# EAGLE design G021H (EAGLE 6.6.0)
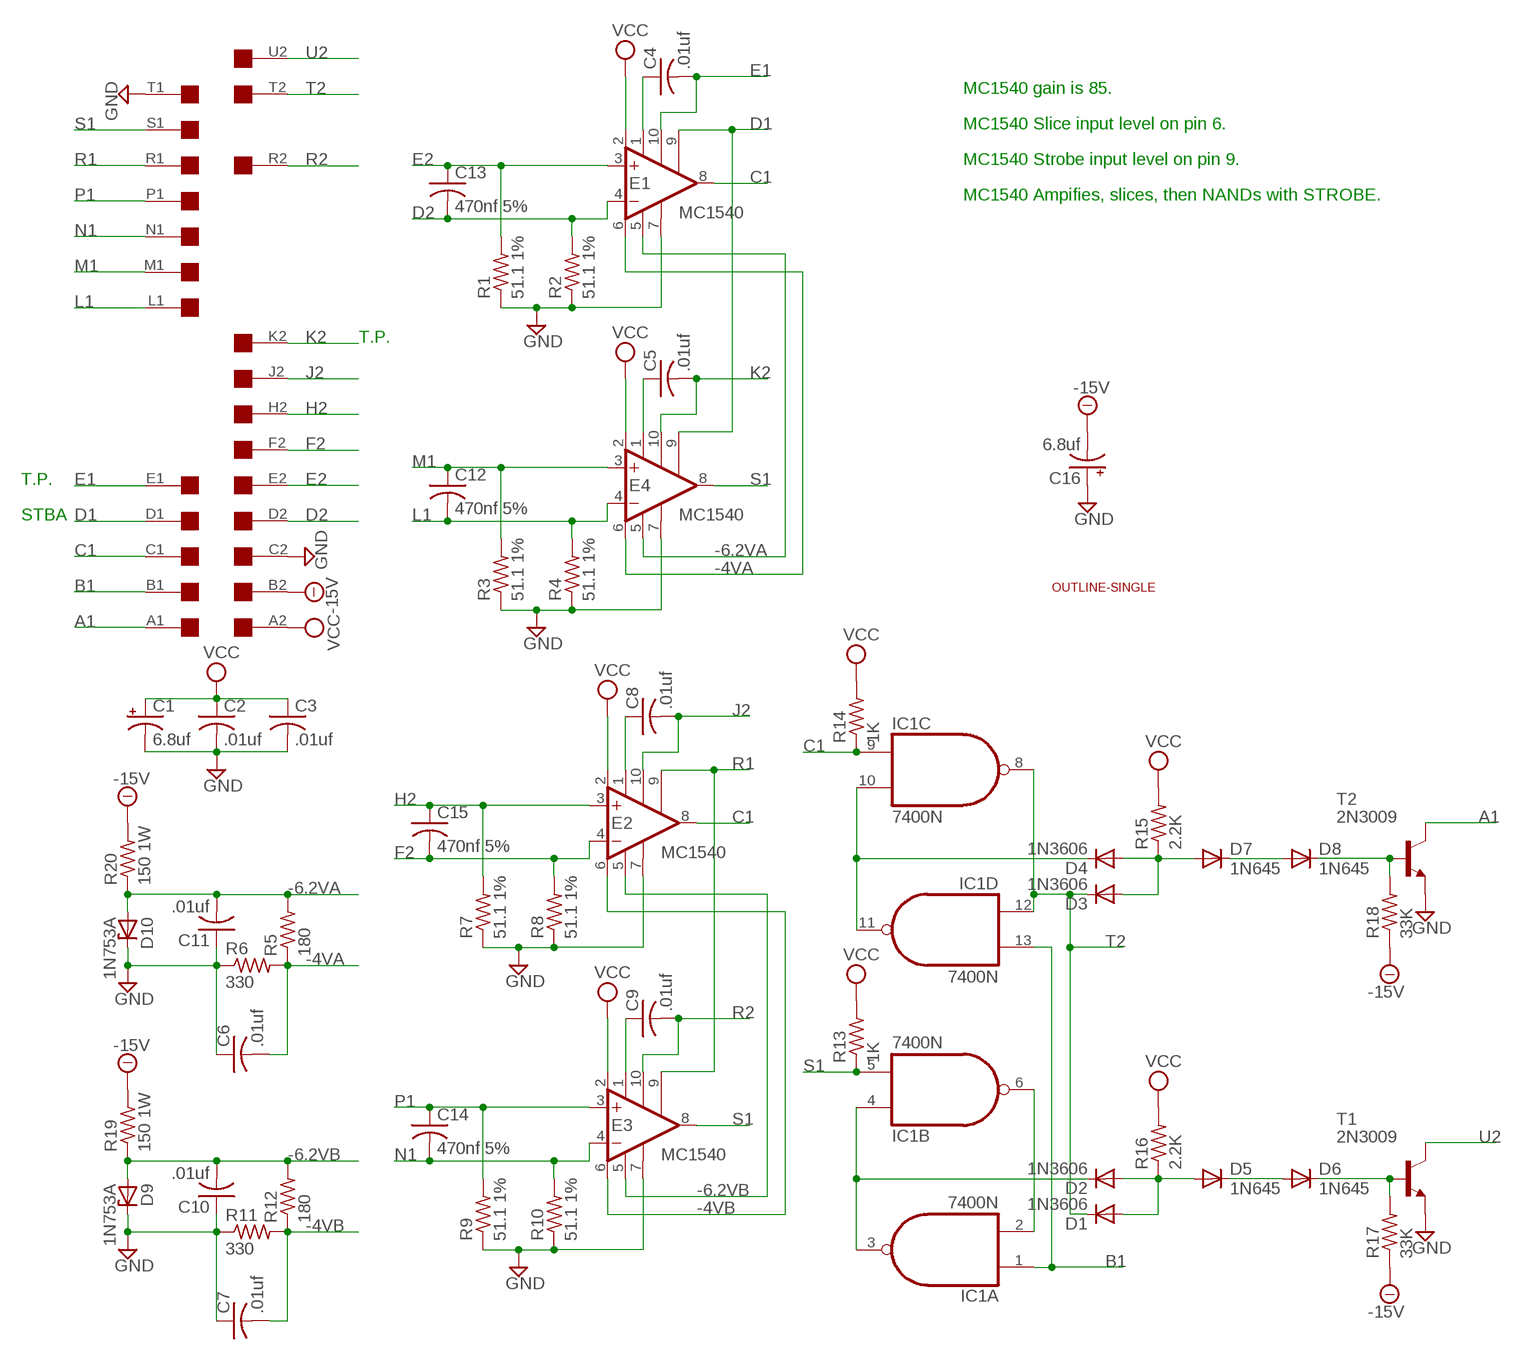
[diagram p0: schematic, sheet 1]

## Parts
C1  6.8uf  CPOL-USE22-6AXIAL  [E22-6]
C2  .01uf  C-US050-025X075  [C050-025X075]
C3  .01uf  C-US050-025X075  [C050-025X075]
C4  .01uf  C-US050-025X075  [C050-025X075]
C5  .01uf  C-US050-025X075  [C050-025X075]
C6  .01uf  C-US050-025X075  [C050-025X075]
C7  .01uf  C-US050-025X075  [C050-025X075]
C8  .01uf  C-US050-025X075  [C050-025X075]
C9  .01uf  C-US050-025X075  [C050-025X075]
C10  .01uf  C-US050-025X075  [C050-025X075]
C11  .01uf  C-US050-025X075  [C050-025X075]
C12  470nf 5%  C-US050-025X075  [C050-025X075]
C13  470nf 5%  C-US050-025X075  [C050-025X075]
C14  470nf 5%  C-US050-025X075  [C050-025X075]
C15  470nf 5%  C-US050-025X075  [C050-025X075]
C16  6.8uf  CPOL-USE22-6AXIAL  [E22-6]
D1  1N3606  1N4148  [DO35-10]
D2  1N3606  1N4148  [DO35-10]
D3  1N3606  1N4148  [DO35-10]
D4  1N3606  1N4148  [DO35-10]
D5  1N645  1N4148  [DO35-10]
D6  1N645  1N4148  [DO35-10]
D7  1N645  1N4148  [DO35-10]
D8  1N645  1N4148  [DO35-10]
D9  1N753A  ZENER-DIODEF126-10  [F126Z10]
D10  1N753A  ZENER-DIODEF126-10  [F126Z10]
E1  MC1540  MC1540G  [602B]
E2  MC1540  MC1540G  [602B]
E3  MC1540  MC1540G  [602B]
E4  MC1540  MC1540G  [602B]
IC1  7400N  [DIL14]
R1  51.1 1%  R-US_0207/10  [0207/10]
R2  51.1 1%  R-US_0207/10  [0207/10]
R3  51.1 1%  R-US_0207/10  [0207/10]
R4  51.1 1%  R-US_0207/10  [0207/10]
R5  180  R-US_0207/10  [0207/10]
R6  330  R-US_0207/10  [0207/10]
R7  51.1 1%  R-US_0207/10  [0207/10]
R8  51.1 1%  R-US_0207/10  [0207/10]
R9  51.1 1%  R-US_0207/10  [0207/10]
R10  51.1 1%  R-US_0207/10  [0207/10]
R11  330  R-US_0207/10  [0207/10]
R12  180  R-US_0207/10  [0207/10]
R13  1K  R-US_0207/10  [0207/10]
R14  1K  R-US_0207/10  [0207/10]
R15  2.2K  R-US_0207/10  [0207/10]
R16  2.2K  R-US_0207/10  [0207/10]
R17  33K  R-US_0207/10  [0207/10]
R18  33K  R-US_0207/10  [0207/10]
R19  150 1W  R-US_0414/15  [0414/15]
R20  150 1W  R-US_0414/15  [0414/15]
T1  2N3009  2N3565  [TO92]
T2  2N3009  2N3565  [TO92]
U$1  SINGLE  [EDGE-CON2]
U$2  OUTLINE-SINGLE  [SINGLE]

## Nets
-4VA: C6.2 E1.6(SLICE) E4.6(SLICE) R5.1 R6.2
-4VB: C7.2 E2.6(SLICE) E3.6(SLICE) R11.2 R12.1
-6.2VA: C11.2 D10.A E1.5(V-) E4.5(V-) R5.2 R20.1
-6.2VB: C10.2 D9.A E2.5(V-) E3.5(V-) R12.2 R19.1
-15V: C16.- R17.1 R18.1 R19.2 R20.2 U$1.B2
A1: T2.1(C) U$1.A1
B1: IC1.1(A:I0) IC1.13(D:I1) U$1.B1
C1: E1.8(OUT) E2.8(OUT) IC1.9(C:I0) R14.1 U$1.C1
D1: E1.9(ISTROBE) E4.9(ISTROBE) U$1.D1
D2: C13.2 E1.4(-IN) R2.2 U$1.D2
E1: C4.2 E1.10(CEXTB) U$1.E1
E2: C13.1 E1.3(+IN) R1.2 U$1.E2
F2: C15.2 E2.4(-IN) R8.2 U$1.F2
GND: C1.- C2.2 C3.2 C6.1 C7.1 C10.1 C11.1 C16.+ D9.C D10.C E1.7(GND) E2.7(GND) E3.7(GND) E4.7(GND) R1.1 R2.1 R3.1 R4.1 R6.1 R7.1 R8.1 R9.1 R10.1 R11.1 T1.3(E) T2.3(E) U$1.C2 U$1.T1
H2: C15.1 E2.3(+IN) R7.2 U$1.H2
J2: C8.2 E2.10(CEXTB) U$1.J2
K2: C5.2 E4.10(CEXTB) U$1.K2
L1: C12.2 E4.4(-IN) R4.2 U$1.L1
M1: C12.1 E4.3(+IN) R3.2 U$1.M1
N1: C14.2 E3.4(-IN) R10.2 U$1.N1
N$1: C4.1 E1.1(CEXTA)
N$2: C8.1 E2.1(CEXTA)
N$3: C5.1 E4.1(CEXTA)
N$4: C9.1 E3.1(CEXTA)
N$6: D1.A D2.A D5.A R16.1
N$7: D4.C IC1.10(C:I1) IC1.11(D:O)
N$8: D2.C IC1.3(A:O) IC1.4(B:I0)
N$9: IC1.2(A:I1) IC1.6(B:O)
N$10: D3.A D4.A D7.A R15.1
N$11: D7.C D8.A
N$12: D5.C D6.A
N$13: D8.C R18.2 T2.2(B)
N$14: D6.C R17.2 T1.2(B)
P1: C14.1 E3.3(+IN) R9.2 U$1.P1
R1: E2.9(ISTROBE) E3.9(ISTROBE) U$1.R1
R2: C9.2 E3.10(CEXTB) U$1.R2
S1: E3.8(OUT) E4.8(OUT) IC1.5(B:I1) R13.1 U$1.S1
T2: D1.C D3.C IC1.8(C:O) IC1.12(D:I0) U$1.T2
U2: T1.1(C) U$1.U2
VCC: C1.+ C2.1 C3.1 E1.2(V+) E2.2(V+) E3.2(V+) E4.2(V+) R13.2 R14.2 R15.2 R16.2 U$1.A2
Unconnected: U$1.F1 U$1.H1 U$1.J1 U$1.K1 U$1.L2 U$1.M2 U$1.N2 U$1.P2 U$1.S2 U$1.U1 U$1.V1 U$1.V2

## Notes on the sheet
- MC1540 gain is 85.
- MC1540 Slice input level on pin 6.
- MC1540 Strobe input level on pin 9.
- MC1540 Ampifies, slices, then NANDs with STROBE.
- T.P.
- T.P.
- STBA

## Power pins joined to a net without a drawn wire
GND: IC1.7(P:GND)
VCC: IC1.14(P:VCC)

## Library data of the parts
C1 C16 = rcl:CPOL-US: POLARIZED CAPACITOR, American symbol
C2-C15 = rcl:C-US: CAPACITOR, American symbol
D1-D8 = diode:1N4148: DIODE high speed (Philips)
D9 D10 = diode:ZENER-DIODE: Z-Diode
E1-E4 = dec-con:MC1540: OP AMP
IC1 = 74xx-us:74*00: Quad 2-input NAND gate
R1-R20 = rcl:R-US_: RESISTOR, American symbol
T1 T2 = transistor:2N3565: NPN TRANSISTOR
U$1 = dec-con:SINGLE: Single-Height DEC board
U$2 = dec-con:OUTLINE-*: Board outlines for DEC boards.

## Board
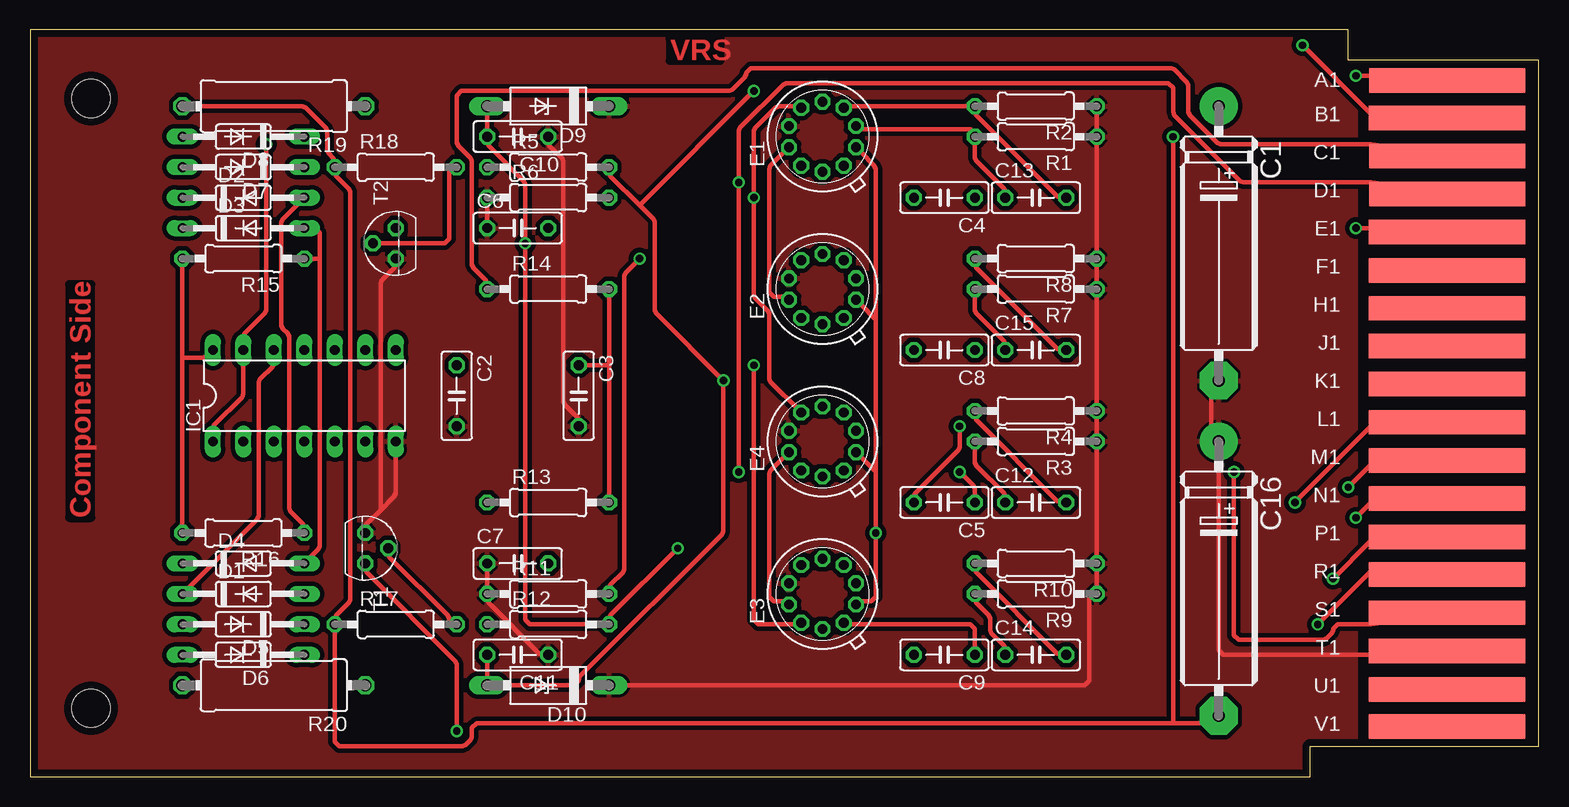
[diagram p1: board, top side]
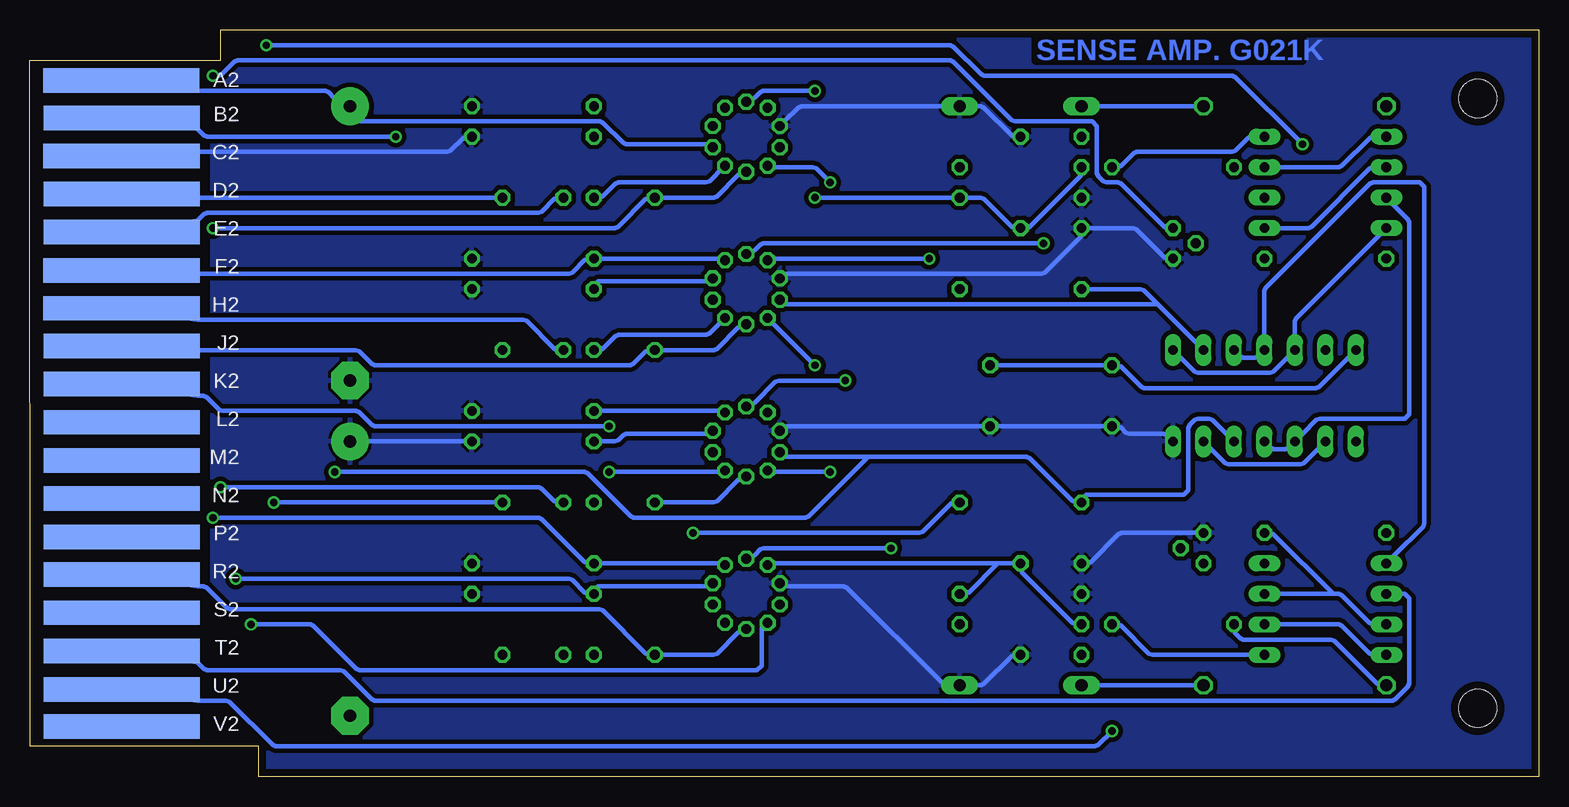
[diagram p2: board, bottom side, seen from below]

Size 125.73 x 62.23 mm. Coordinates in mm from the lower left corner, seen from the top.
Copper layers (1*16): Top 0.035mm / dielectric 1.5mm / Bottom 0.035mm
Design rules "15mils": minimum track width 15mil, minimum drill 24mil, track to track 15mil, track to pad 10mil, pad to pad 10mil, via to via 10mil, smd to smd 10mil, copper to edge 25mil, drill to drill 10mil, minimum pad ring 10mil, minimum via ring 8mil, stop-mask expansion 0mil, vias tented up to drill 0mil, thermal gap 10mil

### Footprints (pad centres in the part's own frame; a part is rotated, then mirrored left to right if it is on the bottom)
E22-6 = drill 1.016 pad 3.15: + -11.43,0 | drill 1.016 pad 3.15 octagon: - 11.43,0
C050-025X075 = drill 0.813 octagon: 1 -2.54,0; 2 2.54,0
DO35-10 = drill 0.813 long: A 5.08,0; C -5.08,0
F126Z10 = drill 1.016 long: A 5.08,0; C -5.08,0
602B = drill 0.813 octagon: 1 -2.413,-1.778; 2 -0.889,-2.794; 3 0.889,-2.794; 4 2.413,-1.778; 5 2.921,0; 6 2.413,1.778; 7 0.889,2.794; 8 -0.889,2.794; 9 -2.413,1.778; 10 -2.921,0
DIL14 = drill 0.813 long: 1 -7.62,-3.81; 2 -5.08,-3.81; 3 -2.54,-3.81; 4 0,-3.81; 5 2.54,-3.81; 6 5.08,-3.81; 7 7.62,-3.81; 8 7.62,3.81; 9 5.08,3.81; 10 2.54,3.81; 11 0,3.81; 12 -2.54,3.81; 13 -5.08,3.81; 14 -7.62,3.81
0207/10 = drill 0.813 octagon: 1 -5.08,0; 2 5.08,0
0414/15 = drill 1.016 octagon: 1 -7.62,0; 2 7.62,0
TO92 = drill 0.813 octagon: 1 1.27,0; 2 0,1.905; 3 -1.27,0
EDGE-CON2 = smd 13.017 x 2.032: A1 7.633,4.207; B1 7.639,7.327; C1 7.636,10.489; D1 7.633,13.665; E1 7.642,16.84; F1 7.642,20.041; H1 7.642,23.19; J1 7.642,26.34; K1 7.642,29.515; L1 7.642,32.69; M1 7.642,35.89; N1 7.642,39.04; P1 7.642,42.24; R1 7.642,45.39; S1 7.642,48.565; T1 7.642,51.74; U1 7.642,54.966; V1 7.642,58.026 | smd 13.017 x 2.032 bottom: A2 7.614,4.207; B2 7.642,7.328; C2 7.617,10.49; D2 7.642,13.665; E2 7.642,16.84; F2 7.617,20.041; H2 7.617,23.19; J2 7.642,26.34; K2 7.642,29.515; L2 7.642,32.69; M2 7.642,35.89; N2 7.642,39.04; P2 7.642,42.24; R2 7.642,45.39; S2 7.642,48.565; T2 7.642,51.74; U2 7.642,54.966; V2 7.642,58.026
SINGLE = hole 3.175: 120.65,56.515; 120.65,5.715

### Placement (x,y rotation side)
C1  99.06,44.45 270 top
C2  35.56,31.75 270 top
C3  45.72,31.75 270 top
C4  76.2,48.26 180 top
C5  76.2,22.86 180 top
C6  40.64,45.72 0 top
C7  40.64,17.78 0 top
C8  76.2,35.56 180 top
C9  76.2,10.16 180 top
C10  40.64,53.34 180 top
C11  40.64,10.16 180 top
C12  83.82,22.86 0 top
C13  83.82,48.26 0 top
C14  83.82,10.16 0 top
C15  83.82,35.56 0 top
C16  99.06,16.51 270 top
D1  17.78,15.24 0 top
D2  17.78,48.26 0 top
D3  17.78,45.72 0 top
D4  17.78,17.78 0 top
D5  17.78,12.7 180 top
D6  17.78,10.16 180 top
D7  17.78,50.8 180 top
D8  17.78,53.34 180 top
D9  43.18,55.88 180 top
D10  43.18,7.62 180 top
E1  66.04,53.34 90 top
E2  66.04,40.64 90 top
E3  66.04,15.24 90 top
E4  66.04,27.94 90 top
IC1  22.86,31.75 0 top
R1  83.82,53.34 180 top
R2  83.82,55.88 180 top
R3  83.82,27.94 180 top
R4  83.82,30.48 180 top
R5  43.18,50.8 0 top
R6  43.18,48.26 0 top
R7  83.82,40.64 180 top
R8  83.82,43.18 180 top
R9  83.82,15.24 180 top
R10  83.82,17.78 180 top
R11  43.18,15.24 0 top
R12  43.18,12.7 0 top
R13  43.18,22.86 0 top
R14  43.18,40.64 0 top
R15  17.78,43.18 180 top
R16  17.78,20.32 180 top
R17  30.48,12.7 0 top
R18  30.48,50.8 0 top
R19  20.32,55.88 180 top
R20  20.32,7.62 180 top
T1  27.94,19.05 270 top
T2  30.48,44.45 90 top
U$1  125.73,62.23 180 top
U$2  125.73,62.23 180 top

### Tracks (layer width: path | path; a pad name or v marks a point on that pad's centre or on a via)
-4VA  (via drill 0.61)
  Top 0.381: E4.6 64.14,30.48 61.71,32.91 61.59,33.18 61.59,38.58 61.48,38.85 60.44,39.89 60.33,40.16 v60.33,48.26 60.33,53.82 60.44,54.09 62.12,55.77 62.39,55.88 63.98,55.88 64.25,55.77 E1.6
  Bottom 0.381: R5.1 38.1,50.32 38.21,50.05 42.43,45.83 42.7,45.72 C6.2 43.66,45.72 43.93,45.83 46.24,48.15 46.51,48.26 47.62,48.26 R6.2 48.9,48.26 v60.33,48.26
-4VB  (via drill 0.61)
  Top 0.381: v50.8,43.18 49.64,42.02 49.53,41.75 49.53,17.3 49.42,17.03 48.37,15.99 48.26,15.72 R11.2
  Bottom 0.381: R12.1 38.58,12.7 38.85,12.81 43.07,17.03 43.18,17.3 C7.2 43.81,17.78 45.09,17.78 | 45.09,17.78 47.51,15.35 47.78,15.24 R11.2 | 45.09,17.78 63.98,17.78 64.25,17.67 E3.6 | v50.8,43.18 63.98,43.18 64.25,43.07 E2.6
-6.2VA  (via drill 0.61)
  Top 0.381: C11.2 38.1,9.53 38.1,8.26 D10.A 39.37,7.62 45.34,7.62 45.72,8 45.72,8.1 45.83,8.37 57.67,20.21 57.78,20.48 v57.78,33.02 52.18,38.62 52.07,38.89 52.07,46.2 51.96,46.47 50.8,47.62 | 50.8,47.62 48.37,50.05 48.26,50.32 R5.2 | 50.8,47.62 v60.33,57.15
  Bottom 0.381: R20.1 28.57,7.62 36.83,7.62 D10.A | v57.78,33.02 63.34,33.02 63.61,32.91 65.35,31.17 65.48,31.09 E4.5 | v60.33,57.15 64.61,57.15 64.88,57.04 65.35,56.57 65.48,56.49 E1.5
-6.2VB  (via drill 0.61)
  Top 0.381: v53.98,19.05 48.37,13.45 48.26,13.18 R12.2 47.62,12.7 41.66,12.7 41.27,13.08 v41.27,44.45 41.27,49.37 41.16,49.64 38.21,52.59 38.1,52.86 C10.2 38.1,53.98 38.1,55.24 D9.A
  Bottom 0.381: R19.1 28.57,55.88 36.83,55.88 D9.A | v53.98,19.05 64.61,19.05 64.88,18.94 65.35,18.47 65.48,18.39 E3.5 | v41.27,44.45 64.61,44.45 64.88,44.34 65.35,43.87 65.48,43.79 E2.5
-15V  (via drill 0.61)
  Top 0.381: R19.2 13.34,55.88 22.7,55.88 22.97,55.77 24.65,54.09 24.77,53.82 24.77,52.23 24.88,51.96 25.29,51.55 25.4,51.28 R18.1 25.4,50.32 25.51,50.05 26.56,49.01 26.67,48.74 26.67,14.76 26.56,14.49 25.51,13.45 25.4,13.18 R17.1 25.4,12.06 25.4,2.92 25.78,2.54 36.04,2.54 36.31,2.65 36.72,3.06 36.83,3.33 36.83,4.06 37.21,4.45 95.25,4.45 | 95.25,4.45 97.7,4.45 97.87,4.49 C16.- | 95.25,4.45 v95.25,53.34
  Bottom 0.381: R17.1 25.4,12.22 25.29,11.95 24.88,11.54 24.61,11.43 17.3,11.43 17.03,11.32 13.45,7.73 13.18,7.62 R20.2 | v95.25,53.34 110.97,53.34 111.24,53.45 111.67,53.89 111.89,53.99 U$1.B2
A1  (via drill 0.61)
  Top 0.381: v110.49,58.42 111.75,58.42 111.77,58.42 U$1.A1
  Bottom 0.381: T2.1 30.96,45.72 31.23,45.83 34.81,49.42 35.08,49.53 36.04,49.53 36.31,49.64 36.72,50.05 36.83,50.32 36.83,54.23 37.21,54.61 43.66,54.61 43.93,54.72 48.78,59.58 49.05,59.69 108.43,59.69 108.7,59.58 109.74,58.53 110.01,58.42 v110.49,58.42
B1  (via drill 0.61)
  Top 0.381: IC1.1 15.24,29.05 15.35,29.32 17.67,31.64 17.78,31.91 17.78,34.29 IC1.13 17.78,36.67 17.89,36.94 19.57,38.62 19.68,38.89 v19.68,52.7 | v106.05,60.96 111.66,55.35 111.91,55.24 U$1.B1
  Bottom 0.381: v19.68,52.7 25.29,58.31 25.56,58.42 46.2,58.42 46.47,58.53 48.78,60.85 49.05,60.96 v106.05,60.96
C1
  Top 0.381: E2.8 62.96,39.94 62.75,40.01 61.98,40.01 61.59,40.39 61.59,50.64 61.71,50.91 62.87,52.07 E1.8 | U$1.C1 111.79,52.7 111.73,52.7 99.22,52.7 98.95,52.82 96.63,55.13 96.52,55.4 96.52,57.63 96.41,57.9 95.36,58.94 95.09,59.05 60.07,59.05 59.69,58.67 59.69,58.58 59.58,58.31 58.53,57.26 58.26,57.15 35.94,57.15 35.56,56.77 35.56,52.86 35.67,52.59 36.72,51.55 36.83,51.28 36.83,42.7 36.94,42.43 37.99,41.39 38.1,41.12 R14.1
  Bottom 0.381: 31.75,39.37 28.57,36.2 IC1.9 | 31.75,39.37 32.91,40.53 33.18,40.64 37.47,40.64 R14.1 | 31.75,39.37 62.71,39.37 62.98,39.48 E2.8
D1  (via drill 0.61)
  Top 0.381: v59.05,25.4 v59.05,49.53 59.05,53.82 59.17,54.09 62.75,57.67 63.02,57.78 94.87,57.78 95.25,57.4 95.25,55.4 95.36,55.13 100.85,49.64 101.12,49.53 111.73,49.53 111.79,49.53 U$1.D1
  Bottom 0.381: v59.05,25.4 63.98,25.4 64.25,25.51 E4.9 | v59.05,49.53 60.21,50.69 60.48,50.8 63.98,50.8 64.25,50.91 E1.9
D2
  Top 0.381: E1.4 67.83,55.77 68.1,55.88 78.11,55.88 R2.2 78.74,55.4 78.85,55.13 85.61,48.37 85.88,48.26 C13.2
  Bottom 0.381: C13.2 87,48.26 111.75,48.26 111.77,48.26 U$1.D2
E1  (via drill 0.61)
  Top 0.381: v110.49,45.72 111.75,45.72 111.77,45.72 U$1.E1
  Bottom 0.381: E1.10 66.6,50.19 66.73,50.11 68.47,48.37 68.74,48.26 73.03,48.26 C4.2 74.14,48.26 74.41,48.15 76.72,45.83 76.99,45.72 v110.49,45.72
E2
  Top 0.381: C13.1 81.28,48.74 81.17,49.01 78.85,51.32 78.74,51.59 78.74,52.7 R1.2 78.74,53.59 78.36,53.98 69.33,53.98 69.12,54.04 E1.3
  Bottom 0.381: C13.1 81.76,48.26 82.03,48.15 83.07,47.1 83.34,46.99 110.97,46.99 111.24,46.88 111.67,46.44 111.88,46.34 U$1.E2
F2
  Top 0.381: R8.2 78.74,42.7 78.85,42.43 85.61,35.67 85.88,35.56 C15.2
  Bottom 0.381: E2.4 67.83,43.07 68.1,43.18 78.11,43.18 R8.2 79.22,43.18 79.49,43.07 80.53,42.02 80.8,41.91 111.75,41.91 111.77,41.91 U$1.F2
GND
  Top 0.381: R6.1 38.1,47.62 38.1,46.35 C6.1 | C7.1 38.1,17.14 38.1,15.88 R11.1 38.1,14.76 38.21,14.49 42.43,10.27 42.7,10.16 C11.1 | 29.21,22.23 30.37,23.38 30.48,23.65 30.48,26.67 IC1.7 | T1.3 27.94,20.8 28.05,21.07 29.21,22.23 | C10.1 43.18,52.86 43.29,52.59 44.34,51.55 44.45,51.28 44.45,31.27 44.56,31 45.61,29.96 45.72,29.69 C3.2 | 29.21,22.23 29.21,41.12 29.32,41.39 30.37,42.43 30.48,42.7 T2.3 | C1.- 98.47,31.83 98.42,31.66 98.42,29.3 98.47,29.13 C16.+ 99.06,26.67 99.06,10.54 99.44,10.16 111.75,10.16 111.77,10.16 U$1.T1 | R2.1 88.9,55.24 88.9,53.98 R1.1 88.9,52.7 88.9,43.81 R8.1 88.9,42.55 88.9,41.27 R7.1 88.9,40.01 88.9,31.11 R4.1 88.9,29.84 88.9,28.57 R3.1 88.9,27.3 88.9,18.41 R10.1 88.9,17.14 88.9,15.88 R9.1 88.65,15.24 88.27,14.86 88.27,8 87.88,7.62 49.53,7.62 D10.C
  Bottom 0.381: T2.3 30.96,43.18 31.23,43.29 33.54,45.61 33.81,45.72 37.47,45.72 C6.1 38.1,45.24 38.21,44.97 41.16,42.02 41.43,41.91 62.71,41.91 62.98,41.8 E2.7 | C11.1 43.66,10.16 43.93,10.05 46.24,7.73 46.51,7.62 46.99,7.62 D10.C 49.37,7.62 49.64,7.73 57.67,15.76 57.94,15.88 62.75,15.88 62.96,15.94 E3.7 | C10.1 43.66,53.34 43.93,53.45 46.24,55.77 46.51,55.88 46.99,55.88 D9.C 49.53,55.88 61.44,55.88 61.71,55.77 62.87,54.61 E1.7 | IC1.7 31,28.46 31.27,28.57 34.13,28.57 34.4,28.69 34.81,29.1 35.08,29.21 C2.2 36.2,29.21 45.09,29.21 C3.2 46.35,29.21 62.71,29.21 62.98,29.1 E4.7 | C7.1 37.62,17.78 37.35,17.89 35.04,20.21 34.77,20.32 28.57,20.32 T1.3 | C16.+ 97.79,27.94 89.53,27.94 R3.1 | R1.1 89.38,53.34 89.65,53.23 90.69,52.18 90.96,52.07 111.75,52.07 111.77,52.07 U$1.C2
  pour Top (isolate 0.381): 0,0 110.11,0 110.49,0.38 110.49,62.23 0.38,62.23 0,61.85
  pour Bottom (isolate 0.381): 0,0 110.11,0 110.49,0.38 110.49,62.23 0.38,62.23 0,61.85
H2
  Top 0.381: C15.1 81.28,36.04 81.17,36.31 78.85,38.62 78.74,38.89 78.74,40.01 R7.2
  Bottom 0.381: E2.3 69.12,41.34 69.33,41.27 78.36,41.27 78.74,40.89 R7.2 | C15.1 81.76,35.56 82.03,35.67 84.34,37.99 84.61,38.1 111.73,38.1 111.79,38.1 U$1.H2
J2
  Bottom 0.381: E2.10 66.6,37.49 66.73,37.41 68.47,35.67 68.74,35.56 73.03,35.56 C8.2 74.14,35.56 74.41,35.45 75.45,34.4 75.72,34.29 97,34.29 97.27,34.4 98.31,35.45 98.58,35.56 111.75,35.56 111.77,35.56 U$1.J2
K2  (via drill 0.61)
  Top 0.381: C5.2 73.66,23.34 73.77,23.61 77.36,27.19 77.47,27.46 v77.47,29.21
  Bottom 0.381: E4.10 66.6,24.79 66.73,24.71 68.47,22.97 68.74,22.86 73.03,22.86 C5.2 | v77.47,29.21 97,29.21 97.27,29.32 98.31,30.37 98.58,30.48 109.7,30.48 109.97,30.59 111.01,31.64 111.28,31.75 111.73,31.75 111.79,31.75 U$1.K2
L1  (via drill 0.61)
  Top 0.381: R4.2 78.74,30 78.85,29.73 85.61,22.97 85.88,22.86 C12.2 | v105.41,22.86 111.66,29.11 111.91,29.22 U$1.L1
  Bottom 0.381: E4.4 67.83,30.37 68.1,30.48 78.11,30.48 R4.2 | v105.41,22.86 87,22.86 C12.2
M1  (via drill 0.61)
  Top 0.381: C12.1 81.28,23.34 81.17,23.61 78.85,25.92 78.74,26.19 78.74,27.3 R3.2 | v109.86,24.13 111.66,25.93 111.91,26.04 U$1.M1
  Bottom 0.381: E4.3 69.12,28.64 69.33,28.57 76.04,28.57 76.31,28.46 76.72,28.05 76.99,27.94 78.11,27.94 R3.2 | C12.1 81.76,22.86 82.03,22.97 83.07,24.02 83.34,24.13 v109.86,24.13
N1  (via drill 0.61)
  Top 0.381: R10.2 78.74,17.3 78.85,17.03 85.61,10.27 85.88,10.16 C14.2 | v110.49,21.59 111.66,22.76 111.91,22.87 U$1.N1
  Bottom 0.381: E3.4 67.83,17.67 68.1,17.78 78.11,17.78 R10.2 79.22,17.78 79.49,17.89 83.07,21.48 83.34,21.59 v110.49,21.59
N$1
  Bottom 0.381: E1.1 67.94,50.8 69.1,49.64 69.37,49.53 76.68,49.53 76.95,49.42 77.99,48.37 78.26,48.26 C4.1
N$2
  Bottom 0.381: E2.1 67.94,38.1 69.1,36.94 69.37,36.83 76.68,36.83 76.95,36.72 77.99,35.67 78.26,35.56 C8.1
N$3  (via drill 0.61)
  Top 0.381: v77.47,25.4 78.63,24.24 78.74,23.97 78.74,23.5 C5.1
  Bottom 0.381: E4.1 67.83,25.51 68.1,25.4 v77.47,25.4
N$4
  Top 0.381: E3.1 67.83,12.81 68.1,12.7 78.36,12.7 78.74,12.32 78.74,10.79 C9.1
N$6
  Top 0.381: D2.A 22.23,47.62 21.07,46.47 20.95,46.2 20.95,37.62 21.07,37.35 21.48,36.94 21.59,36.67 21.59,22.38 21.7,22.11 22.75,21.07 22.86,20.8 R16.1
  Bottom 0.381: 17.14,15.24 21.59,15.24 D1.A | D5.A 13.81,12.7 14.08,12.81 16.4,15.13 16.67,15.24 17.14,15.24 | 17.14,15.24 22.11,20.21 22.38,20.32 R16.1
N$7
  Bottom 0.381: D4.C 12.06,18.41 9.64,20.84 9.53,21.11 9.53,49.15 9.91,49.53 13.81,49.53 14.08,49.42 22.75,40.75 22.86,40.48 22.86,36.83 IC1.11 23.38,35.04 23.65,34.92 24.61,34.92 24.88,35.04 IC1.10
N$8
  Bottom 0.381: IC1.4 22.34,27.42 22.07,27.3 21.11,27.3 20.84,27.42 IC1.3 19.68,28.57 18.53,29.73 18.26,29.84 11.18,29.84 10.79,30.23 10.79,46.2 10.91,46.47 12.06,47.62 D2.C
N$9
  Bottom 0.381: IC1.2 18.41,27.3 19.57,26.15 19.84,26.04 25.88,26.04 26.15,26.15 27.3,27.3 IC1.6
N$10
  Top 0.381: 24.13,43.18 24.13,19.21 24.02,18.94 23.5,18.41 D4.A | 24.13,43.18 24.13,45.34 23.75,45.72 D3.A | 24.13,43.18 23.5,43.18 R15.1
  Bottom 0.381: D7.A 13.81,50.8 14.08,50.69 18.94,45.83 19.21,45.72 21.59,45.72 D3.A
N$11
  Bottom 0.381: D8.A 13.81,53.34 14.08,53.23 16.4,50.91 16.67,50.8 21.59,50.8 D7.C
N$12
  Bottom 0.381: D6.A 13.81,10.16 14.08,10.27 16.4,12.59 16.67,12.7 21.59,12.7 D5.C
N$13
  Top 0.381: T2.2 29.21,44.45 34.54,44.45 34.92,44.83 34.92,50.42 35.31,50.8 R18.2
  Bottom 0.381: D8.C 23.97,53.34 24.24,53.23 25.29,52.18 25.56,52.07 33.5,52.07 33.77,51.96 34.81,50.91 35.08,50.8 R18.2
N$14
  Top 0.381: R17.2 35.31,12.7 34.92,13.08 34.92,13.18 34.81,13.45 29.96,18.3 29.84,18.57 T1.2
  Bottom 0.381: D6.C 24.13,10.16 32.23,10.16 32.5,10.27 34.81,12.59 35.08,12.7 R17.2
P1  (via drill 0.61)
  Top 0.381: C14.1 81.28,10.64 81.17,10.91 80.12,11.95 80.01,12.22 80.01,13.18 79.9,13.45 78.85,14.49 78.74,14.76 R9.2 | v108.58,16.51 111.66,19.58 111.91,19.69 U$1.P1
  Bottom 0.381: E3.3 69.12,15.94 69.33,15.88 78.36,15.88 78.74,15.49 R9.2 79.22,15.24 79.49,15.35 80.53,16.4 80.8,16.51 v108.58,16.51
R1  (via drill 0.61)
  Top 0.381: E3.9 64.25,12.81 63.98,12.7 60.71,12.7 60.33,13.08 v60.33,34.29 | v107.31,12.7 111.64,17.03 111.93,17.14 U$1.R1
  Bottom 0.381: v60.33,34.29 64.14,38.1 E2.9 | v107.31,12.7 102.39,12.7 102.12,12.59 98.54,9 98.27,8.89 65.15,8.89 64.77,9.27 64.77,12.4 64.48,12.77 E3.9
R2
  Bottom 0.381: E3.10 66.6,12.09 66.73,12.01 68.47,10.27 68.74,10.16 73.03,10.16 C9.2 74.14,10.16 74.41,10.27 77.99,13.86 78.26,13.97 109.06,13.97 109.33,14.08 111.01,15.76 111.28,15.88 111.73,15.88 111.79,15.88 U$1.R2
S1  (via drill 0.61)
  Top 0.381: E3.8 62.96,14.54 62.75,14.61 61.98,14.61 61.59,14.99 61.59,25.24 61.71,25.51 62.87,26.67 E4.8 | v100.33,25.4 100.33,11.81 100.71,11.43 107.79,11.43 108.06,11.54 108.47,11.95 108.58,12.22 108.58,12.32 108.97,12.7 111.73,12.7 111.79,12.7 U$1.S1
  Bottom 0.381: 55.88,26.67 42.7,26.67 42.43,26.56 38.85,22.97 38.58,22.86 R13.1 38.1,23.11 37.72,23.5 29.59,23.5 29.21,23.88 29.21,29.05 29.1,29.32 28.69,29.73 28.42,29.84 27.46,29.84 27.19,29.73 26.04,28.57 IC1.5 | 55.88,26.67 62.71,26.67 62.98,26.78 E4.8 | v100.33,25.4 79.53,25.4 79.26,25.29 75.68,21.7 75.41,21.59 61.12,21.59 60.85,21.7 55.88,26.67
T2
  Top 0.381: D1.C 13.34,15.88 18.94,21.48 19.05,21.75 19.05,32.86 19.16,33.13 20.21,34.18 20.32,34.45 IC1.12
  Bottom 0.381: D3.C 13.34,45.09 20.21,38.21 20.32,37.94 20.32,36.83 IC1.12 20.95,34.92 22.11,33.77 22.38,33.66 28.42,33.66 28.69,33.77 29.84,34.92 IC1.8 | U$1.T2 111.88,9.54 111.67,9.44 111.24,9 110.97,8.89 99.85,8.89 99.58,8.78 97.27,6.46 97,6.35 12.22,6.35 11.95,6.46 10.91,7.51 10.79,7.78 10.79,14.86 11.18,15.24 11.43,15.24 D1.C
U2  (via drill 0.61)
  Top 0.381: v35.56,3.81 35.56,9.37 35.45,9.64 28.05,17.03 27.94,17.3 T1.1
  Bottom 0.381: v35.56,3.81 36.72,2.65 36.99,2.54 105.25,2.54 105.52,2.65 109.11,6.24 109.38,6.35 111.73,6.35 111.79,6.35 U$1.U2
VCC  (via drill 0.61)
  Top 0.381: 12.7,34.92 12.7,42.55 R15.2 | 12.7,34.92 12.7,20.95 R16.2 | 12.7,34.92 14.45,34.92 14.72,35.04 IC1.14 | 48.26,34.29 48.26,40.01 R14.2 | 48.26,34.29 48.26,23.5 R13.2 | 48.26,34.29 46.35,34.29 C3.1 | 70.48,25.4 v70.48,20.32 70.48,14.99 70.1,14.61 69.33,14.61 69.12,14.54 E3.2 | 70.48,25.4 69.22,26.67 E4.2 | 70.48,25.4 70.48,38.1 | 70.48,38.1 69.22,39.37 E2.2 | 70.48,38.1 70.48,50.64 70.37,50.91 69.22,52.07 E1.2
  Bottom 0.381: C3.1 45.09,34.29 36.2,34.29 C2.1 35.08,34.29 34.81,34.18 33.13,32.5 32.86,32.38 18.57,32.38 18.3,32.5 15.88,34.92 IC1.14 | U$1.A2 111.79,57.15 111.73,57.15 101.12,57.15 100.85,57.04 100.37,56.56 100.28,56.49 C1.+ 98.53,54.82 98.19,54.61 78.26,54.61 77.99,54.5 76.31,52.82 76.04,52.7 69.33,52.7 69.12,52.64 E1.2 | R13.2 48.74,22.86 49.01,22.75 51.32,20.43 51.59,20.32 v70.48,20.32

### Text on the board
Top: VRS | Component Side
Bottom: SENSE AMP. G021K
Document: Layout is based on G021H.